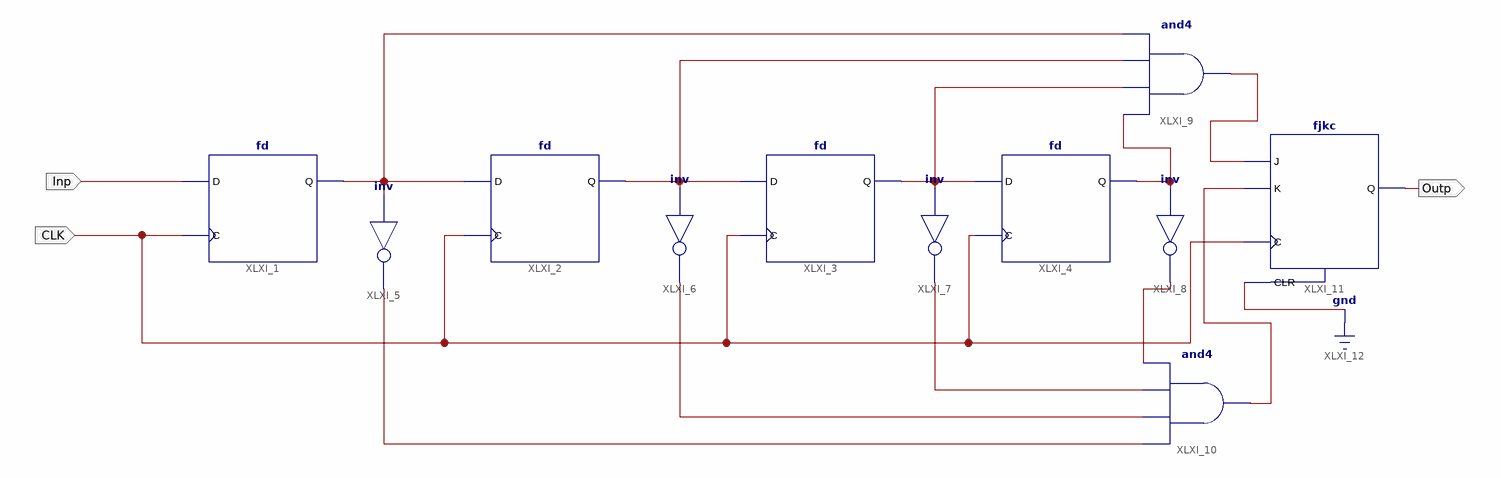
[diagram p0: schematic sheet 1]
// Xilinx ISE schematic Digital_Filter.sch (spartan3e) as structural Verilog: 11 symbols, 3 ports
module Digital_Filter (
  input  CLK,
  input  Inp,
  output Outp
);

  wire XLXN_11, XLXN_12, XLXN_13, XLXN_14, XLXN_15, XLXN_16, XLXN_17, XLXN_18, XLXN_26, XLXN_27;

  fd XLXI_1 (.C(CLK), .D(Inp), .Q(XLXN_18));
  fd XLXI_2 (.C(CLK), .D(XLXN_18), .Q(XLXN_17));
  fd XLXI_3 (.C(CLK), .D(XLXN_17), .Q(XLXN_16));
  fd XLXI_4 (.C(CLK), .D(XLXN_16), .Q(XLXN_15));
  not XLXI_5 (XLXN_14, XLXN_18);
  not XLXI_6 (XLXN_13, XLXN_17);
  not XLXI_7 (XLXN_12, XLXN_16);
  not XLXI_8 (XLXN_11, XLXN_15);
  and XLXI_9 (XLXN_26, XLXN_15, XLXN_16, XLXN_17, XLXN_18);
  and XLXI_10 (XLXN_27, XLXN_14, XLXN_13, XLXN_12, XLXN_11);
  fjkc XLXI_11 (.C(CLK), .CLR(1'b0), .J(XLXN_26), .K(XLXN_27), .Q(Outp));
endmodule
